# Altium schematic sheet ModCon.SchDoc: Module Connector
size A4; DrawnBy: A. Küllenberg; Revision: A; SheetNumber: 7; SheetTotal: 10
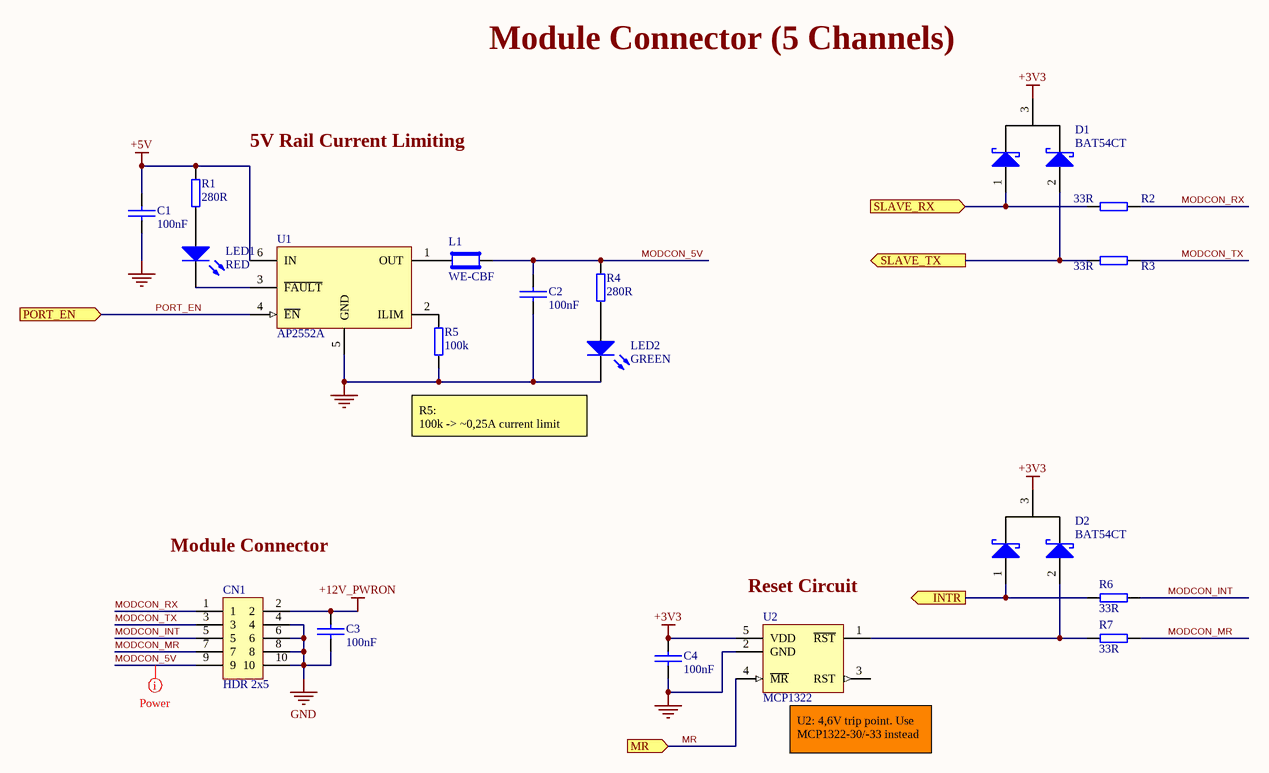
[diagram p0: ModCon.SchDoc]

## Parts
C1  100nF  [C0603]
C2  100nF  [C0603]
C3  100nF  [C0603]
C4  100nF  [C0603]
CN1  HDR 2x5  [SBH11-PBPC-D05-RA-BK]
D1  BAT54CT  [SOT-523]
D2  BAT54CT  [SOT-523]
L1  WE-CBF  [L0603]
LED1  RED  [LED_0603_RED]
LED2  GREEN  [LED_0603_GREEN]
R1  280R  [R0603]
R2  33R  [R0603]
R3  33R  [R0603]
R4  280R  [R0603]
R5  100k  [R0603]
R6  33R  [R0603]
R7  33R  [R0603]
U1  AP2552A  [SOT26]
U2  MCP1322  [SOT23-5]

## Ports
INTR (out), MR (in), PORT_EN (in), SLAVE_RX (in), SLAVE_TX (out)

## Nets
+3V3: C4.2 D1.3(A) D2.3(A) U2.5(VDD)
+5V: C1.2 R1.2 U1.6(IN)
+12V_PWRON: C3.2 CN1.2
GND: C1.1 C2.1 C3.1 C4.1 CN1.4 CN1.6 CN1.8 CN1.10 LED2.2(K) R5.1 U1.5(GND) U2.2(GND)
INTR: D2.1(K) R6.1 ; port INTR
MODCON_5V: C2.2 CN1.9 L1.2 R4.2
MODCON_INT: CN1.5 R6.2
MODCON_MR: CN1.7 R7.2
MODCON_RX: CN1.1 R2.2
MODCON_TX: CN1.3 R3.2
MR: U2.4(~{MR}) ; port MR
PORT_EN: U1.4(~{EN}) ; port PORT_EN
SLAVE_RX: D1.1(K) R2.1 ; port SLAVE_RX
SLAVE_TX: D1.2(K) R3.1 ; port SLAVE_TX
NetD2_2: D2.2(K) R7.1 U2.1(~{RST})
NetL1_1: L1.1 U1.1(OUT)
NetLED1_1: LED1.1(A) R1.1
NetLED1_2: LED1.2(K) U1.3(~{FAULT})
NetLED2_1: LED2.1(A) R4.1
NetR5_2: R5.2 U1.2(ILIM)

Not connected (* = marked no-connect by the designer): U2 3(RST)

## Layout directives
net class Power: MODCON_5V

## Notes on the sheet
- Module Connector (5 Channels)
- (near R1) 5V Rail Current Limiting
- R5:
  100k -> ~0,25A current limit
- Module Connector
- (near U2) Reset Circuit
- (near U2) U2: 4,6V trip point. Use MCP1322-30/-33 instead

## Library data of the parts
C1-C4 = C0603C104K5RACTU: CAP CER 0.1UF 50V X7R 0603; Manufacturer: Kemet; Capacitance: 0.10µF; Tolerance: ±10%; Part Number: C0603C104K5RACTU; Value: 100nF; Supplier 1: Digi-Key; Supplier Part Number 1: 399-5089-1-ND; Manufacturer Part Number: C0603C104K5RACTU; RoHS: RoHS Compliant; Category: Capacitors; Stock 1: 1628757; Pricing 1: 1=0.09, 10=0.037, 50=0.0198, 100=0.0167, 250=0.01372, 500=0.01174, 1000=0.00914 (EUR); Packaging: Cut Tape (CT); Voltage - Rated: 50V; Temperature Coefficient: X7R; Mounting Type: Surface Mount, MLCC; Operating Temperature: -55°C ~ 125°C; Applications: General Purpose; Ratings: -; Package / Case: 0603 (1608 Metric); Size / Dimension: 0.063" L x 0.031" W (1.60mm x 0.80mm); Height - Seated (Max): -; Thickness (Max): 0.034" (0.87mm); Lead Spacing: -; Features: -; Lead Style: -; ComponentLink1URL: http://www.kemet.com/docfinder?Partnumber=C0603C104K5RACTU; ComponentLink1Description: http://www.kemet.com/docfinder?Partnumber=C0603C104K5RACTU
CN1 = SBH11-PBPC-D05-RA-BK: CONN HEADR 2.54MM 10POS GOLD R/A; Manufacturer: Sullins Connector Solutions; Connector Type: Header; Number of Positions: 10; Number of Positions Loaded: All; Current Rating: 3A; Pitch - Mating: 0.100" (2.54mm); Shrouding: Shrouded - 4 Wall; Style: Board to Board or Cable; Contact Length - Post: 0.126" (3.20mm); Material Flammability Rating: UL94 V-0; Mated Stacking Heights: 9.65mm, 11.2mm, 13.35mm, 18.35mm; Part Number: SBH11-PBPC-D05-RA-BK; Value: HDR 2x5; Supplier 1: Digi-Key; Supplier Part Number 1: S9177-ND; Manufacturer Part Number: SBH11-PBPC-D05-RA-BK; RoHS: RoHS Compliant; Category: Connectors, Interconnects; Stock 1: 16639; Pricing 1: 1=0.78, 10=0.61, 25=0.5688, 50=0.517, 100=0.4652, 250=0.3928, 500=0.37212, 1000=0.33078, 2500=0.27496 (EUR); Packaging: Tray; Contact Type: Male Pin; Number of Rows: 2; Mounting Type: Through Hole, Right Angle; Termination: Solder; Fastening Type: -; Features: Keying Slot; ComponentLink1URL: http://sullinscorp.com/catalogs/145_PAGE118_.100_SBH11_SERIES_MALE_BOX_HDR_ST_RA_SMT.pdf; ComponentLink1Description: http://sullinscorp.com/catalogs/145_PAGE118_.100_SBH11_SERIES_MALE_BOX_HDR_ST_RA_SMT.pdf; Voltage Rating: -; Contact Material: Brass; Operating Temperature: -40°C ~ 105°C; Part Status: Active; Row Spacing - Mating: 0.100" (2.54mm); Contact Length - Mating: -; Contact Finish - Mating: Gold; Contact Finish Thickness - Mating: Flash; Insulation Color: Black; Overall Contact Length: -; Insulation Height: 0.358" (9.10mm); Contact Shape: Square; Ingress Protection: -; Contact Finish - Post: Gold; Insulation Material: Polybutylene Terephthalate (PBT); Contact Finish Thickness - Post: Flash; Applications: -
D1 D2 = BAT54CT-7-F: DIODE ARRAY SCHOTTKY 30V SOT523; Manufacturer: Diodes Incorporated; Current - Reverse Leakage @ Vr: 2µA @ 25V; Voltage - Forward (Vf) (Max) @ If: 1V @ 100mA; Speed: Small Signal =< 200mA (Io), Any Speed; Reverse Recovery Time (trr): 5ns; Diode Configuration: 1 Pair Common Cathode; Current - Average Rectified (Io) (per Diode): 200mA (DC); Part Number: BAT54CT-7-F; Value: BAT54CT; Supplier 1: Digi-Key; Supplier Part Number 1: BAT54CT-FDICT-ND; Manufacturer Part Number: BAT54CT-7-F; RoHS: RoHS Compliant; Category: Discrete Semiconductor Products; Stock 1: 22; Pricing 1: 1=0.44, 10=0.327, 100=0.185, 500=0.12252, 1000=0.09393 (EUR); Packaging: Cut Tape (CT); Mounting Type: Surface Mount; Package / Case: SOT-523; Supplier Device Package: SOT-523; ComponentLink1URL: http://www.diodes.com/_files/datasheets/ds30259.pdf; ComponentLink1Description: http://www.diodes.com/_files/datasheets/ds30259.pdf; Diode Type: Schottky; Voltage - DC Reverse (Vr) (Max): 30V; Operating Temperature - Junction: -65°C ~ 125°C; Part Status: Active
L1 = 742792651: FERRITE BEAD 600 OHM 0603 1LN; Manufacturer: Wurth Electronics Inc.; Filter Type: Signal Line; Number of Lines: 1; Impedance @ Frequency: 600 Ohm @ 100MHz; Current Rating (Max): 1A; DC Resistance (DCR) (Max): 200 mOhm; Part Number: 742792651; Value: WE-CBF; Supplier 1: Digi-Key; Supplier Part Number 1: 732-1593-1-ND; Manufacturer Part Number: 742792651; RoHS: RoHS Compliant; Category: Filters; Stock 1: 99870; Pricing 1: 1=0.22, 10=0.185, 50=0.1806, 100=0.1667, 1000=0.15164 (EUR); Packaging: Cut Tape (CT); Part Status: Active; Ratings: -; Operating Temperature: -55°C ~ 125°C; Package / Case: 0603 (1608 Metric); Mounting Type: Surface Mount; Height (Max): 0.039" (1.00mm); Size / Dimension: 0.063" L x 0.031" W (1.60mm x 0.80mm); ComponentLink1URL: http://katalog.we-online.de/pbs/datasheet/742792651.pdf; ComponentLink1Description: http://katalog.we-online.de/pbs/datasheet/742792651.pdf
LED1 = LTST-C190KRKT: LED RED CLEAR 0603 SMD; Manufacturer: Lite-On Inc.; Voltage - Forward (Vf) (Typ): 2V; Viewing Angle: 130°; Wavelength - Dominant: 631nm; Wavelength - Peak: 639nm; Millicandela Rating: 99mcd; Current - Test: 20mA; Lens Color: Colorless; Lens Style/Size: Rectangle with Flat Top, 1.10mm x 0.80mm; Part Number: LTST-C190KRKT; Value: RED; Supplier 1: Digi-Key; Supplier Part Number 1: 160-1436-1-ND; Manufacturer Part Number: LTST-C190KRKT; RoHS: RoHS Compliant; Category: Optoelectronics; Stock 1: 1183099; Pricing 1: 1=0.24, 10=0.176, 25=0.1296, 100=0.0926, 250=0.063, 500=0.05556, 1000=0.04353 (EUR); Packaging: Cut Tape (CT); Mounting Type: Surface Mount; Package / Case: 0603 (1608 Metric); ComponentLink1URL: http://optoelectronics.liteon.com/upload/download/DS-22-99-0151/S_110_LTST-C190KRKT.pdf; ComponentLink1Description: http://optoelectronics.liteon.com/upload/download/DS-22-99-0151/S_110_LTST-C190KRKT.pdf; Supplier Device Package: *; Color: Red; Lens Transparency: Clear; Size / Dimension: 1.60mm L x 0.80mm W; Height (Max): 0.80mm; Features: -
LED2 = LTST-C190KGKT: LED GREEN CLEAR 0603 SMD; Manufacturer: Lite-On Inc.; Voltage - Forward (Vf) (Typ): 2V; Viewing Angle: 130°; Wavelength - Dominant: 571nm; Wavelength - Peak: 574nm; Millicandela Rating: 35mcd; Current - Test: 20mA; Lens Color: Colorless; Lens Style/Size: Rectangle with Flat Top, 1.10mm x 0.80mm; Part Number: LTST-C190KGKT; Value: GREEN; Supplier 1: Digi-Key; Supplier Part Number 1: 160-1435-1-ND; Manufacturer Part Number: LTST-C190KGKT; RoHS: RoHS Compliant; Category: Optoelectronics; Stock 1: 1245030; Pricing 1: 1=0.24, 10=0.176, 25=0.1296, 100=0.0926, 250=0.063, 500=0.05556, 1000=0.04353 (EUR); Packaging: Cut Tape (CT); Mounting Type: Surface Mount; Package / Case: 0603 (1608 Metric); ComponentLink1URL: http://optoelectronics.liteon.com/upload/download/DS22-2000-074/S_110_LTST-C190KGKT.pdf; ComponentLink1Description: http://optoelectronics.liteon.com/upload/download/DS22-2000-074/S_110_LTST-C190KGKT.pdf; Supplier Device Package: *; Color: Green; Lens Transparency: Clear; Size / Dimension: 1.60mm L x 0.80mm W; Height (Max): 0.80mm; Features: -
R1 R4 = RC0603FR-07280RL: RES SMD 280 OHM 1% 1/10W 0603; Manufacturer: Yageo; Resistance (Ohms): 280; Power (Watts): 0.1W, 1/10W; Temperature Coefficient: ±100ppm/°C; Part Number: RC0603FR-07280RL; Value: 280R; Manufacturer Part Number: RC0603FR-07280RL; RoHS: RoHS Compliant; Category: Resistors; Stock 1: 47; Pricing 1: 1=0.09, 10=0.012, 25=0.0088, 50=0.0066, 100=0.0049, 250=0.00372, 500=0.00298, 1000=0.0022 (EUR); Packaging: Cut Tape (CT); Tolerance: ±1%; Composition: Thick Film; Features: Moisture Resistant; Operating Temperature: -55°C ~ 155°C; Package / Case: 0603 (1608 Metric); Supplier Device Package: 0603; Size / Dimension: 0.063" L x 0.031" W (1.60mm x 0.80mm); ComponentLink1URL: http://www.yageo.com/documents/recent/PYu-RC_Group_51_RoHS_L_6.pdf; ComponentLink1Description: http://www.yageo.com/documents/recent/PYu-RC_Group_51_RoHS_L_6.pdf; Supplier 1: Digi-Key; Supplier Part Number 1: 311-280HRCT-ND; Height - Seated (Max): 0.022" (0.55mm); Part Status: Active; Failure Rate: -
R2 R3 R6 R7 = RC0603JR-0733RL: RES SMD 33 OHM 5% 1/10W 0603; Manufacturer: Yageo; Resistance (Ohms): 33; Power (Watts): 0.1W, 1/10W; Temperature Coefficient: ±100ppm/°C; Part Number: RC0603JR-0733RL; Value: 33R; Manufacturer Part Number: RC0603JR-0733RL; RoHS: RoHS Compliant; Category: Resistors; Stock 1: 791191; Pricing 1: 1=0.09, 10=0.009, 25=0.0068, 50=0.005, 100=0.0038, 250=0.00292, 500=0.0023, 1000=0.0017 (EUR); Packaging: Cut Tape (CT); Tolerance: ±5%; Composition: Thick Film; Features: Moisture Resistant; Operating Temperature: -55°C ~ 155°C; Package / Case: 0603 (1608 Metric); Supplier Device Package: 0603; Size / Dimension: 0.063" L x 0.031" W (1.60mm x 0.80mm); ComponentLink1URL: http://www.yageo.com/documents/recent/PYu-RC_Group_51_RoHS_L_6.pdf; ComponentLink1Description: http://www.yageo.com/documents/recent/PYu-RC_Group_51_RoHS_L_6.pdf; Supplier 1: Digi-Key; Supplier Part Number 1: 311-33GRCT-ND; Height - Seated (Max): 0.022" (0.55mm); Part Status: Active; Failure Rate: -
R5 = RC0603FR-07100KL: RES SMD 100K OHM 1% 1/10W 0603; Manufacturer: Yageo; Power (Watts): 0.1W, 1/10W; Temperature Coefficient: ±100ppm/°C; Part Number: RC0603FR-07100KL; Value: 100k; Manufacturer Part Number: RC0603FR-07100KL; RoHS: RoHS Compliant; Category: Resistors; Stock 1: 6595647; Pricing 1: 1=0.09, 10=0.012, 25=0.0088, 50=0.007, 100=0.0051, 250=0.00388, 500=0.0031, 1000=0.00229 (EUR); Packaging: Cut Tape (CT); Resistance (Ohms): 100k; Tolerance: ±1%; Composition: Thick Film; Features: Moisture Resistant; Operating Temperature: -55°C ~ 155°C; Package / Case: 0603 (1608 Metric); Supplier Device Package: 0603; Size / Dimension: 0.063" L x 0.031" W (1.60mm x 0.80mm); ComponentLink1URL: http://www.yageo.com/documents/recent/PYu-RC_Group_51_RoHS_L_7.pdf; ComponentLink1Description: http://www.yageo.com/documents/recent/PYu-RC_Group_51_RoHS_L_7.pdf; Supplier 1: Digi-Key; Supplier Part Number 1: 311-100KHRCT-ND; Height - Seated (Max): 0.022" (0.55mm); Part Status: Active; Failure Rate: -
U1 = AP2552AW6-7: IC PD SW CURR LIMIT SOT26; Manufacturer: Diodes Incorporated; Switch Type: General Purpose; Number of Outputs: 1; Output Configuration: High Side; Output Type: P-Channel; Interface: On/Off; Voltage - Load: 2.7 V ~ 5.5 V; Voltage - Supply (Vcc/Vdd): Not Required; Current - Output (Max): 2.1A; Rds On (Typ): 70 mOhm; Input Type: Non-Inverting; Fault Protection: Current Limiting (Adjustable), Over Temperature, Reverse Current, UVLO; Part Number: AP2552AW6-7; Value: AP2552A; Supplier 1: Digi-Key; Supplier Part Number 1: AP2552AW6-7DICT-ND; Manufacturer Part Number: AP2552AW6-7; RoHS: RoHS Compliant; Category: Integrated Circuits (ICs); Stock 1: 1661; Pricing 1: 1=0.47, 10=0.401, 100=0.2994, 500=0.2353, 1000=0.18182 (EUR); Packaging: Cut Tape (CT); Features: Load Discharge, Status Flag; Operating Temperature: -40°C ~ 125°C (TJ); Package / Case: SOT-23-6; Supplier Device Package: SOT-26; ComponentLink1URL: http://www.diodes.com/_files/datasheets/AP255x.pdf; ComponentLink1Description: http://www.diodes.com/_files/datasheets/AP255x.pdf; Part Status: Active
U2 = MCP1322T-46LE/OT: IC SUPERVISOR 4.6V SOT23-5; Manufacturer: Microchip Technology; Output: Open Drain, Push-Pull; Reset: Active High/Active Low; Reset Timeout: 140 ms Minimum; Part Number: MCP1322T-46LE/OT; Value: MCP1322; Supplier 1: Digi-Key; Supplier Part Number 1: MCP1322T-46LE/OTCT-ND; Manufacturer Part Number: MCP1322T-46LE/OT; RoHS: RoHS Compliant; Category: Integrated Circuits (ICs); Stock 1: 5889; Pricing 1: 1=0.58, 25=0.4764, 100=0.4375 (EUR); Packaging: Cut Tape (CT); Part Status: Active; Operating Temperature: -40°C ~ 125°C (TA); Mounting Type: Surface Mount; Package / Case: SC-74A, SOT-753; Supplier Device Package: SOT-23-5; ComponentLink1URL: http://www.microchip.com/mymicrochip/filehandler.aspx?ddocname=en025429; ComponentLink1Description: http://www.microchip.com/mymicrochip/filehandler.aspx?ddocname=en025429; Type: Simple Reset/Power-On Reset; Voltage - Threshold: 4.6V